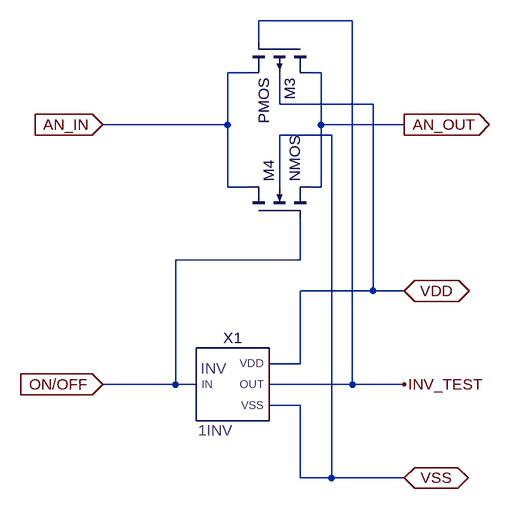
[diagram p0: schematic ANALOG_SWITCH.asc]
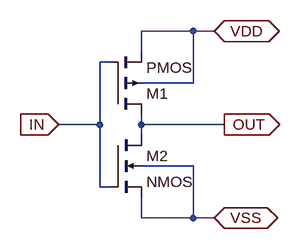
[diagram p1: sub-circuit 1inv.asc]
ANALOG_SWITCH.asc, the LTspice schematic file:
Version 4
SHEET 1 880 680
WIRE 336 -480 192 -480
WIRE 192 -448 192 -480
WIRE 176 -400 144 -400
WIRE 288 -400 272 -400
WIRE 224 -352 224 -400
WIRE 368 -352 224 -352
WIRE 144 -320 144 -400
WIRE 144 -320 -48 -320
WIRE 288 -320 288 -400
WIRE 416 -320 288 -320
WIRE 304 -304 224 -304
WIRE 144 -224 144 -320
WIRE 176 -224 144 -224
WIRE 224 -224 224 -304
WIRE 288 -224 288 -320
WIRE 288 -224 272 -224
WIRE 256 -112 256 -176
WIRE 256 -112 64 -112
WIRE 368 -64 368 -352
WIRE 368 -64 256 -64
WIRE 416 -64 368 -64
WIRE 256 48 256 -64
WIRE 256 48 208 48
WIRE 64 80 64 -112
WIRE 64 80 -48 80
WIRE 96 80 64 80
WIRE 336 80 336 -480
WIRE 336 80 208 80
WIRE 416 80 336 80
WIRE 256 112 208 112
WIRE 256 224 256 112
WIRE 304 224 304 -304
WIRE 304 224 256 224
WIRE 416 224 304 224
FLAG -48 -320 AN_IN
IOPIN -48 -320 In
FLAG 416 -320 AN_OUT
IOPIN 416 -320 Out
FLAG 416 80 INV_TEST
FLAG 416 -64 VDD
IOPIN 416 -64 BiDir
FLAG 416 224 VSS
IOPIN 416 224 BiDir
FLAG -48 80 ON/OFF
IOPIN -48 80 In
SYMBOL pmos4 272 -448 R90
SYMATTR InstName M3
SYMATTR Value2 l=L w=W
SYMBOL nmos4 176 -176 R270
SYMATTR InstName M4
SYMATTR Value2 l=L w=W
SYMBOL 1INV 144 80 R0
SYMATTR InstName X1

1inv.asc, the sub-circuit schematic file:
Version 4
SHEET 1 880 680
WIRE 224 -16 144 -16
WIRE 256 -16 224 -16
WIRE 144 16 144 -16
WIRE 96 32 80 32
WIRE 224 64 224 -16
WIRE 224 64 144 64
WIRE 80 128 80 32
WIRE 80 128 16 128
WIRE 144 128 144 112
WIRE 272 128 144 128
WIRE 144 144 144 128
WIRE 224 192 144 192
WIRE 80 224 80 128
WIRE 96 224 80 224
WIRE 144 272 144 240
WIRE 224 272 224 192
WIRE 224 272 144 272
WIRE 256 272 224 272
FLAG 16 128 IN
IOPIN 16 128 In
FLAG 272 128 OUT
IOPIN 272 128 Out
FLAG 256 -16 VDD
IOPIN 256 -16 BiDir
FLAG 256 272 VSS
IOPIN 256 272 BiDir
SYMBOL pmos4 96 112 M180
SYMATTR InstName M1
SYMATTR Value2 l=110nM w=180nM
SYMBOL nmos4 96 144 R0
SYMATTR InstName M2
SYMATTR Value2 l=110nM w=180nM

The netlist it stands for:
* ANALOG_SWITCH.asc
M3 AN_OUT INV_TEST AN_IN VDD PMOS l=L w=W
M4 AN_IN ON/OFF AN_OUT VSS NMOS l=L w=W
XX1 ON/OFF INV_TEST VDD VSS 1inv

* block symbol definitions
.subckt 1inv IN OUT VDD VSS
M1 OUT IN VDD VDD PMOS l=110nM w=180nM
M2 OUT IN VSS VSS NMOS l=110nM w=180nM
.ends 1inv

.model NMOS NMOS
.model PMOS PMOS
.lib standard.mos
.backanno
.end